# Altium schematic sheet Wrist.SchDoc
size A4; SheetNumber: 2; SheetTotal: 2
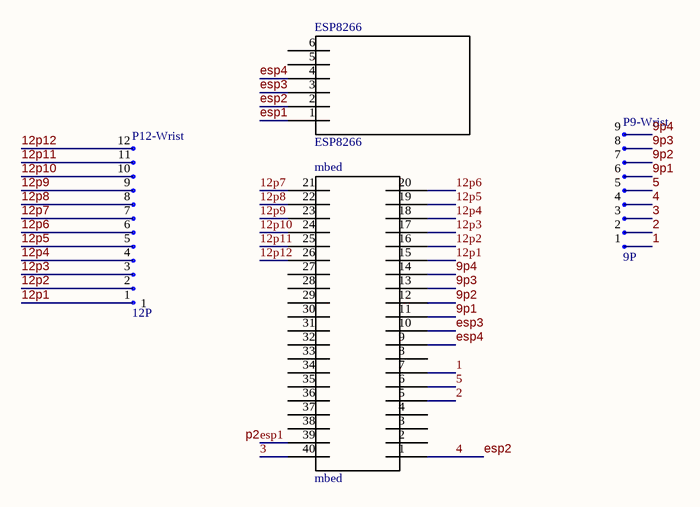
[diagram p0: Wrist.SchDoc]

## Parts
ESP8266  ESP8266  [ESP8266]
mbed  mbed  [Mbed]
P9-Wrist  9P  [9p]
P12-Wrist  12P  [12P]

## Nets
1: mbed.7 P9-Wrist.1
2: mbed.5 P9-Wrist.2
3: mbed.40 P9-Wrist.3
4: ESP8266.2 mbed.1 P9-Wrist.4  [also labelled esp2]
5: mbed.6 P9-Wrist.5
9p1: mbed.11 P9-Wrist.6
9p2: mbed.12 P9-Wrist.7
9p3: mbed.13 P9-Wrist.8
9p4: mbed.14 P9-Wrist.9
12p1: mbed.15 P12-Wrist.1
12p2: mbed.16 P12-Wrist.2
12p3: mbed.17 P12-Wrist.3
12p4: mbed.18 P12-Wrist.4
12p5: mbed.19 P12-Wrist.5
12p6: mbed.20 P12-Wrist.6
12p7: mbed.21 P12-Wrist.7
12p8: mbed.22 P12-Wrist.8
12p9: mbed.23 P12-Wrist.9
12p10: mbed.24 P12-Wrist.10
12p11: mbed.25 P12-Wrist.11
12p12: mbed.26 P12-Wrist.12
esp1: ESP8266.1 mbed.39
esp3: ESP8266.3 mbed.10
esp4: ESP8266.4 mbed.9

Not connected (* = marked no-connect by the designer): ESP8266 5 6; mbed 2 3 4 8 27 28 29 30 31 32 33 34 35 36 37 38

## Notes on the sheet
- Labels drawn without touching a wire or pin: p2